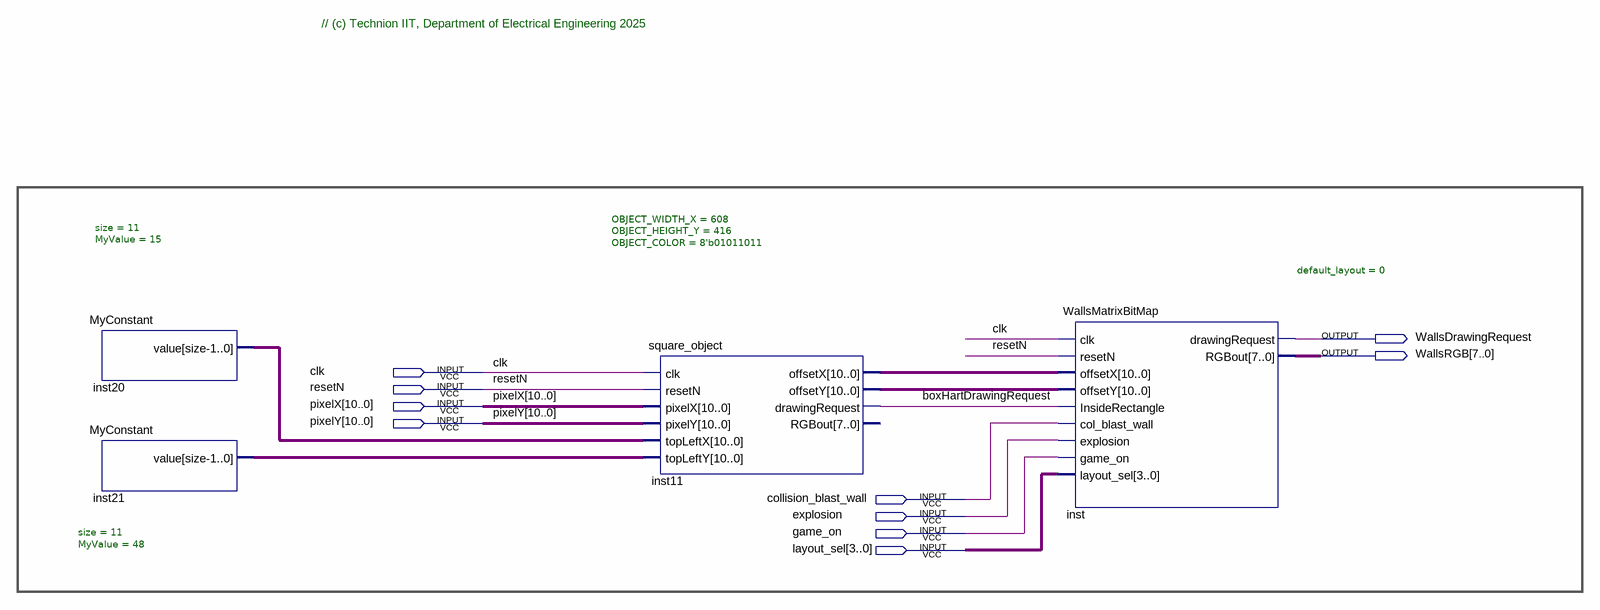
[diagram p0: schematic sheet]
// Quartus schematic WALLS_DISPLAY.bdf as structural Verilog: 4 symbols, 10 pins
module WALLS_DISPLAY (
  input  clk,
  input  resetN,
  input  [10:0] pixelX,
  input  [10:0] pixelY,
  input  collision_blast_wall,
  input  explosion,
  input  game_on,
  input  [3:0] layout_sel,
  output WallsDrawingRequest,
  output [7:0] WallsRGB
);

  wire boxHartDrawingRequest;
  wire [10:0] inst11_offsetx, inst11_offsety, inst20_value, inst21_value;

  MyConstant #(.size(11), .MyValue(15)) inst20 (.value(inst20_value));
  MyConstant #(.size(11), .MyValue(48)) inst21 (.value(inst21_value));
  square_object #(.OBJECT_WIDTH_X(608), .OBJECT_HEIGHT_Y(416), .OBJECT_COLOR(8'b01011011)) inst11 (
    .clk(clk), .resetN(resetN), .pixelX(pixelX), .pixelY(pixelY), .topLeftX(inst20_value),
    .topLeftY(inst21_value), .offsetX(inst11_offsetx), .offsetY(inst11_offsety),
    .drawingRequest(boxHartDrawingRequest));  // open: RGBout
  WallsMatrixBitMap #(.default_layout(0)) inst (
    .clk(clk), .resetN(resetN), .offsetX(inst11_offsetx), .offsetY(inst11_offsety),
    .InsideRectangle(boxHartDrawingRequest), .col_blast_wall(collision_blast_wall), .explosion(explosion),
    .game_on(game_on), .layout_sel(layout_sel), .drawingRequest(WallsDrawingRequest), .RGBout(WallsRGB));

  // Notes on the sheet:
  //   // (c) Technion IIT, Department of Electrical Engineering 2025
endmodule
